# Altium project RS-485-USB.PrjPcb
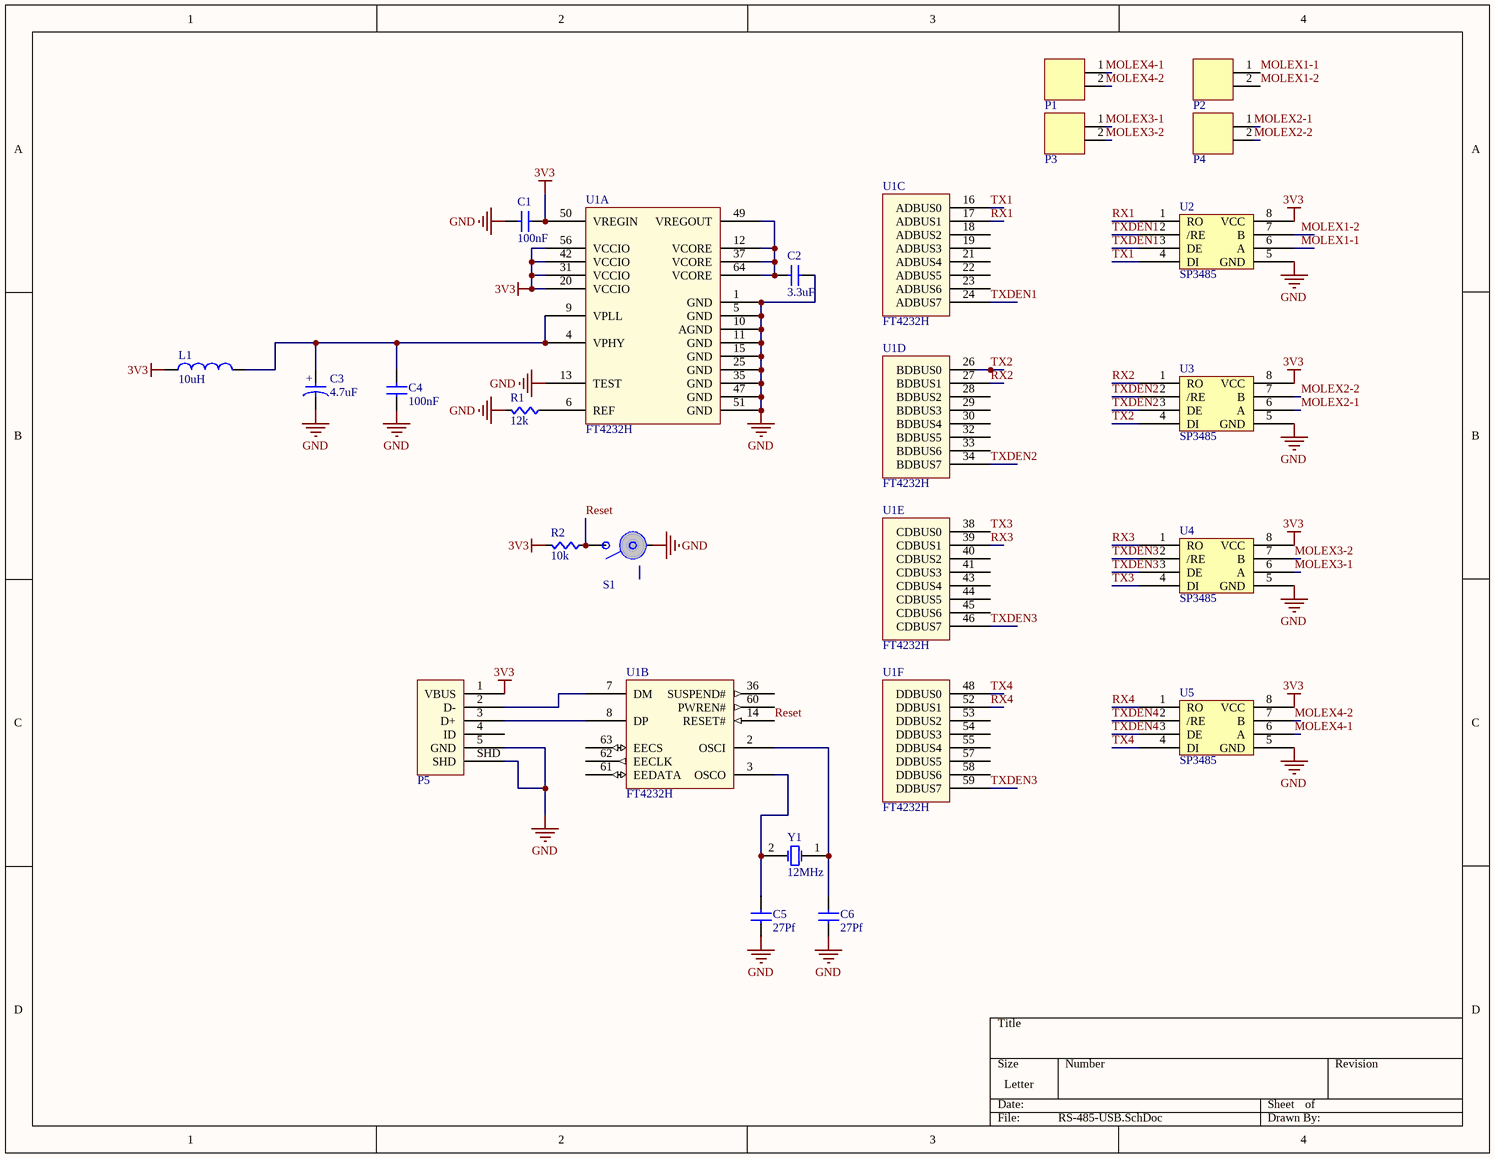
[diagram p0: RS-485-USB.SchDoc]
1 sheet, 21 parts. Net scope: global (net labels, ports and power ports of the same name join across sheets).
Board file: RS-485-USB.PcbDoc

## Sheet RS-485-USB.SchDoc
size Letter

### Parts
C1  value 100nF  [CAPC0603]  (hidden comment: Cap)
C2  value 3.3uF  [CAPC0603]  (hidden comment: Cap)
C3  value 4.7uF  [CAPP0603]  (hidden comment: CapPol)
C4  value 100nF  [CAPC0603]  (hidden comment: Cap)
C5  value 27Pf  [CAPC0603]  (hidden comment: Cap)
C6  value 27Pf  [CAPC0603]  (hidden comment: Cap)
L1  Inductance: 10uH  [CDPH4D19F]  (hidden comment: Inductor)
P1  2-pin Horz Sherlock  [MOLEX-HDR-1X2-SHERLOCK-HORZ]  (value not drawn)
P2  2-pin Horz Sherlock  [MOLEX-HDR-1X2-SHERLOCK-HORZ]  (value not drawn)
P3  2-pin Horz Sherlock  [MOLEX-HDR-1X2-SHERLOCK-HORZ]  (value not drawn)
P4  2-pin Horz Sherlock  [MOLEX-HDR-1X2-SHERLOCK-HORZ]  (value not drawn)
P5  USB Micro  [10118192-0001LF]  (value not drawn)
R1  value 12k  [RES0603]  (hidden comment: Res)
R2  value 10k  [RES0603]  (hidden comment: Res)
S1  Button  [PTS645xxxxSMTR92]  (value not drawn)
U1  FT4232H  [FT4232HL]  (parts A,B,C,D,E,F of 6)
U2  SP3485  [SP3485]
U3  SP3485  [SP3485]
U4  SP3485  [SP3485]
U5  SP3485  [SP3485]
Y1  12MHz  [R38]

### Nets
3V3: C1.2(B) L1.1(A) P5.1(VBUS) R2.1(A) U1.20(VCCIO) U1.31(VCCIO) U1.42(VCCIO) U1.50(VREGIN) U1.56(VCCIO) U2.8(VCC) U3.8(VCC) U4.8(VCC) U5.8(VCC)
GND: C1.1(A) C2.1(A) C3.2(B) C4.1(A) C5.2(B) C6.2(B) P5.5(GND) P5.SHD R1.1(A) S1.A U1.1(GND) U1.5(GND) U1.10(AGND) U1.11(GND) U1.13(TEST) U1.15(GND) U1.25(GND) U1.35(GND) U1.47(GND) U1.51(GND) U2.5(GND) U3.5(GND) U4.5(GND) U5.5(GND)
MOLEX1-1: P2.1 U2.6(A)
MOLEX1-2: P2.2 U2.7(B)
MOLEX2-1: P4.1 U3.6(A)
MOLEX2-2: P4.2 U3.7(B)
MOLEX3-1: P3.1 U4.6(A)
MOLEX3-2: P3.2 U4.7(B)
MOLEX4-1: P1.1 U5.6(A)
MOLEX4-2: P1.2 U5.7(B)
Reset: R2.2(B) S1.B U1.14(RESET#)
RX1: U1.17(ADBUS1) U2.1(RO)
RX2: U1.27(BDBUS1) U3.1(RO)
RX3: U1.39(CDBUS1) U4.1(RO)
RX4: U1.52(DDBUS1) U5.1(RO)
TX1: U1.16(ADBUS0) U2.4(DI)
TX2: U1.26(BDBUS0) U3.4(DI)
TX3: U1.38(CDBUS0) U4.4(DI)
TX4: U1.48(DDBUS0) U5.4(DI)
TXDEN1: U1.24(ADBUS7) U2.2(/RE) U2.3(DE)
TXDEN2: U1.34(BDBUS7) U3.2(/RE) U3.3(DE)
TXDEN3: U1.46(CDBUS7) U1.59(DDBUS7) U4.2(/RE) U4.3(DE)
TXDEN4: U5.2(/RE) U5.3(DE)
NetC2_2: C2.2(B) U1.12(VCORE) U1.37(VCORE) U1.49(VREGOUT) U1.64(VCORE)
NetC3_1: C3.1(A) C4.2(B) L1.2(B) U1.4(VPHY) U1.9(VPLL)
NetC5_1: C5.1(A) U1.3(OSCO) Y1.2(OSC2)
NetC6_1: C6.1(A) U1.2(OSCI) Y1.1(OSC1)
NetP5_2: P5.2(D-) U1.7(DM)
NetP5_3: P5.3(D+) U1.8(DP)
NetR1_2: R1.2(B) U1.6(REF)

Not connected (* = marked no-connect by the designer): P5 4(ID); U1 18(ADBUS2) 19(ADBUS3) 21(ADBUS4) 22(ADBUS5) 23(ADBUS6) 28(BDBUS2) 29(BDBUS3) 30(BDBUS4) 32(BDBUS5) 33(BDBUS6) 36(SUSPEND#) 40(CDBUS2) 41(CDBUS3) 43(CDBUS4) 44(CDBUS5) 45(CDBUS6) 53(DDBUS2) 54(DDBUS3) 55(DDBUS4) 57(DDBUS5) 58(DDBUS6) 60(PWREN#) 61(EEDATA) 62(EECLK) 63(EECS)

### Notes on the sheet
- (in symbol CapPol) +

### Library data of the parts
P1-P4 = MOLEX-HDR-1x2-SHERLOCK_RA: Header, Molex, 2mm Pitch Sherlock Header, Single Row, Horizontal, 2 Circuits, Length 3.3mm,  0353630260; Manufacturer: Molex Inc; Manufacturer Part Number: 0353630260; Supplier Part Number: WM18931-ND; Supplier: Digi-Key
P5 = USB Micro: USB Mini B Metal Shield SMT; Supplier 1: Digi-Key; Supplier Part Number 1: 609-4613-1-ND
S1 = Button: SPST Button; Supplier 1: Digi-Key; Supplier Part Number 1: CKN9087CT-ND
U1 = FT4232H: Quad High Speed USB to Multipurpose UART/MPSSE; Supplier 1: Digi-Key; Supplier Part Number 1: 768-1026-1-ND
U2-U5 = SP3485: IC TXRX RS485 HALF DUPLEX 8NSOIC; Supplier 1: Digi-Key; Supplier Part Number 1: 1016-1817-1-ND
Y1 = XTAL: Crystal Oscillator; Published: 8-Jun-2000; LatestRevisionDate: 17-Jul-2002; LatestRevisionNote: Re-released for DXP Platform.; PackageReference: R38; Publisher: Altium Limited; PackageDescription: Crystal, Thru-Hole; 2 Leads; Body 3.1 x 8.2 mm (Dia.xH)
C1 C2 C4-C6 = Cap: Supplier 1: Digi-Key; Supplier Part Number 1: 1276-1000-1-ND
C3 = CapPol: Supplier 1: Digi-Key; Supplier Part Number 1: 1276-2087-1-ND
R1 R2 = Res: Supplier 1: Digi-Key
  R1: Supplier Part Number 1: RMCF0603FT12K0CT-ND
  R2: Supplier Part Number 1: RMCF0603JT10K0CT-ND